# Altium schematic sheet SD_MMC.SchDoc
size A3
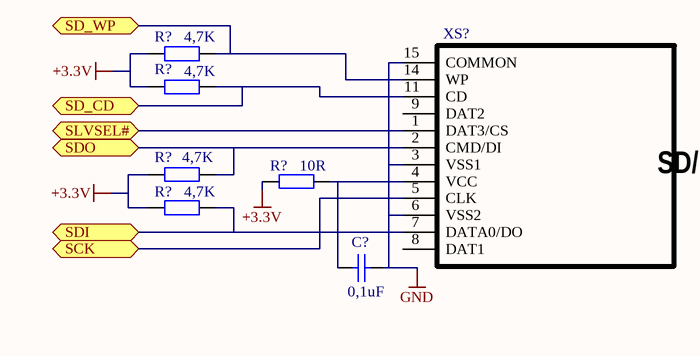
[diagram p0: SD_MMC.SchDoc]

## Parts
(Parts that share a designator on the sheet are numbered #1, #2 ... from top to bottom, then left to right.)
C?  value 0,1uF  [C_0805]  (hidden comment: Cap_Semi)
R?#1  value 4,7K  [R_1206]  (hidden comment: Resistor 1206)
R?#2  value 4,7K  [R_1206]  (hidden comment: Resistor 1206)
R?#3  value 4,7K  [R_1206]  (hidden comment: Resistor 1206)
R?#4  value 10R  [R_1206]  (hidden comment: Resistor 1206)
R?#5  value 4,7K  [R_1206]  (hidden comment: Resistor 1206)
XS?  SD_MCC  [SD Card]  (value not drawn)

## Ports
SCK (bidir), SD_CD (bidir), SD_WP (bidir), SDI (bidir), SDO (bidir), SLVSEL# (bidir)

## Nets
+3.3V: R?#1.2 R?#2.2 R?#3.2 R?#4.2 R?#5.2
GND: C?.2 XS?.3(VSS1) XS?.6(VSS2) XS?.15(COMMON)
SCK: XS?.5(CLK) ; port SCK
SD_CD: R?#2.1 XS?.11(CD) ; port SD_CD
SD_WP: R?#1.1 XS?.14(WP) ; port SD_WP
SDI: R?#5.1 XS?.7(DATA0/DO) ; port SDI
SDO: R?#3.1 XS?.2(CMD/DI) ; port SDO
SLVSEL#: XS?.1(DAT3/CS) ; port SLVSEL#
NetC?_1: C?.1 R?#4.1 XS?.4(VCC)

Not connected (* = marked no-connect by the designer): XS? 8(DAT1) 9(DAT2)

## Notes on the sheet
- (in symbol SD_MCC) SD/MMC

## Library data of the parts
C? = Cap_Semi: Capacitor Semi
XS? = SD_MCC: SD razyem